# Altium schematic sheet SCH_Project_Final.SchDoc
size A3; SheetNumber: 1; SheetTotal: 1
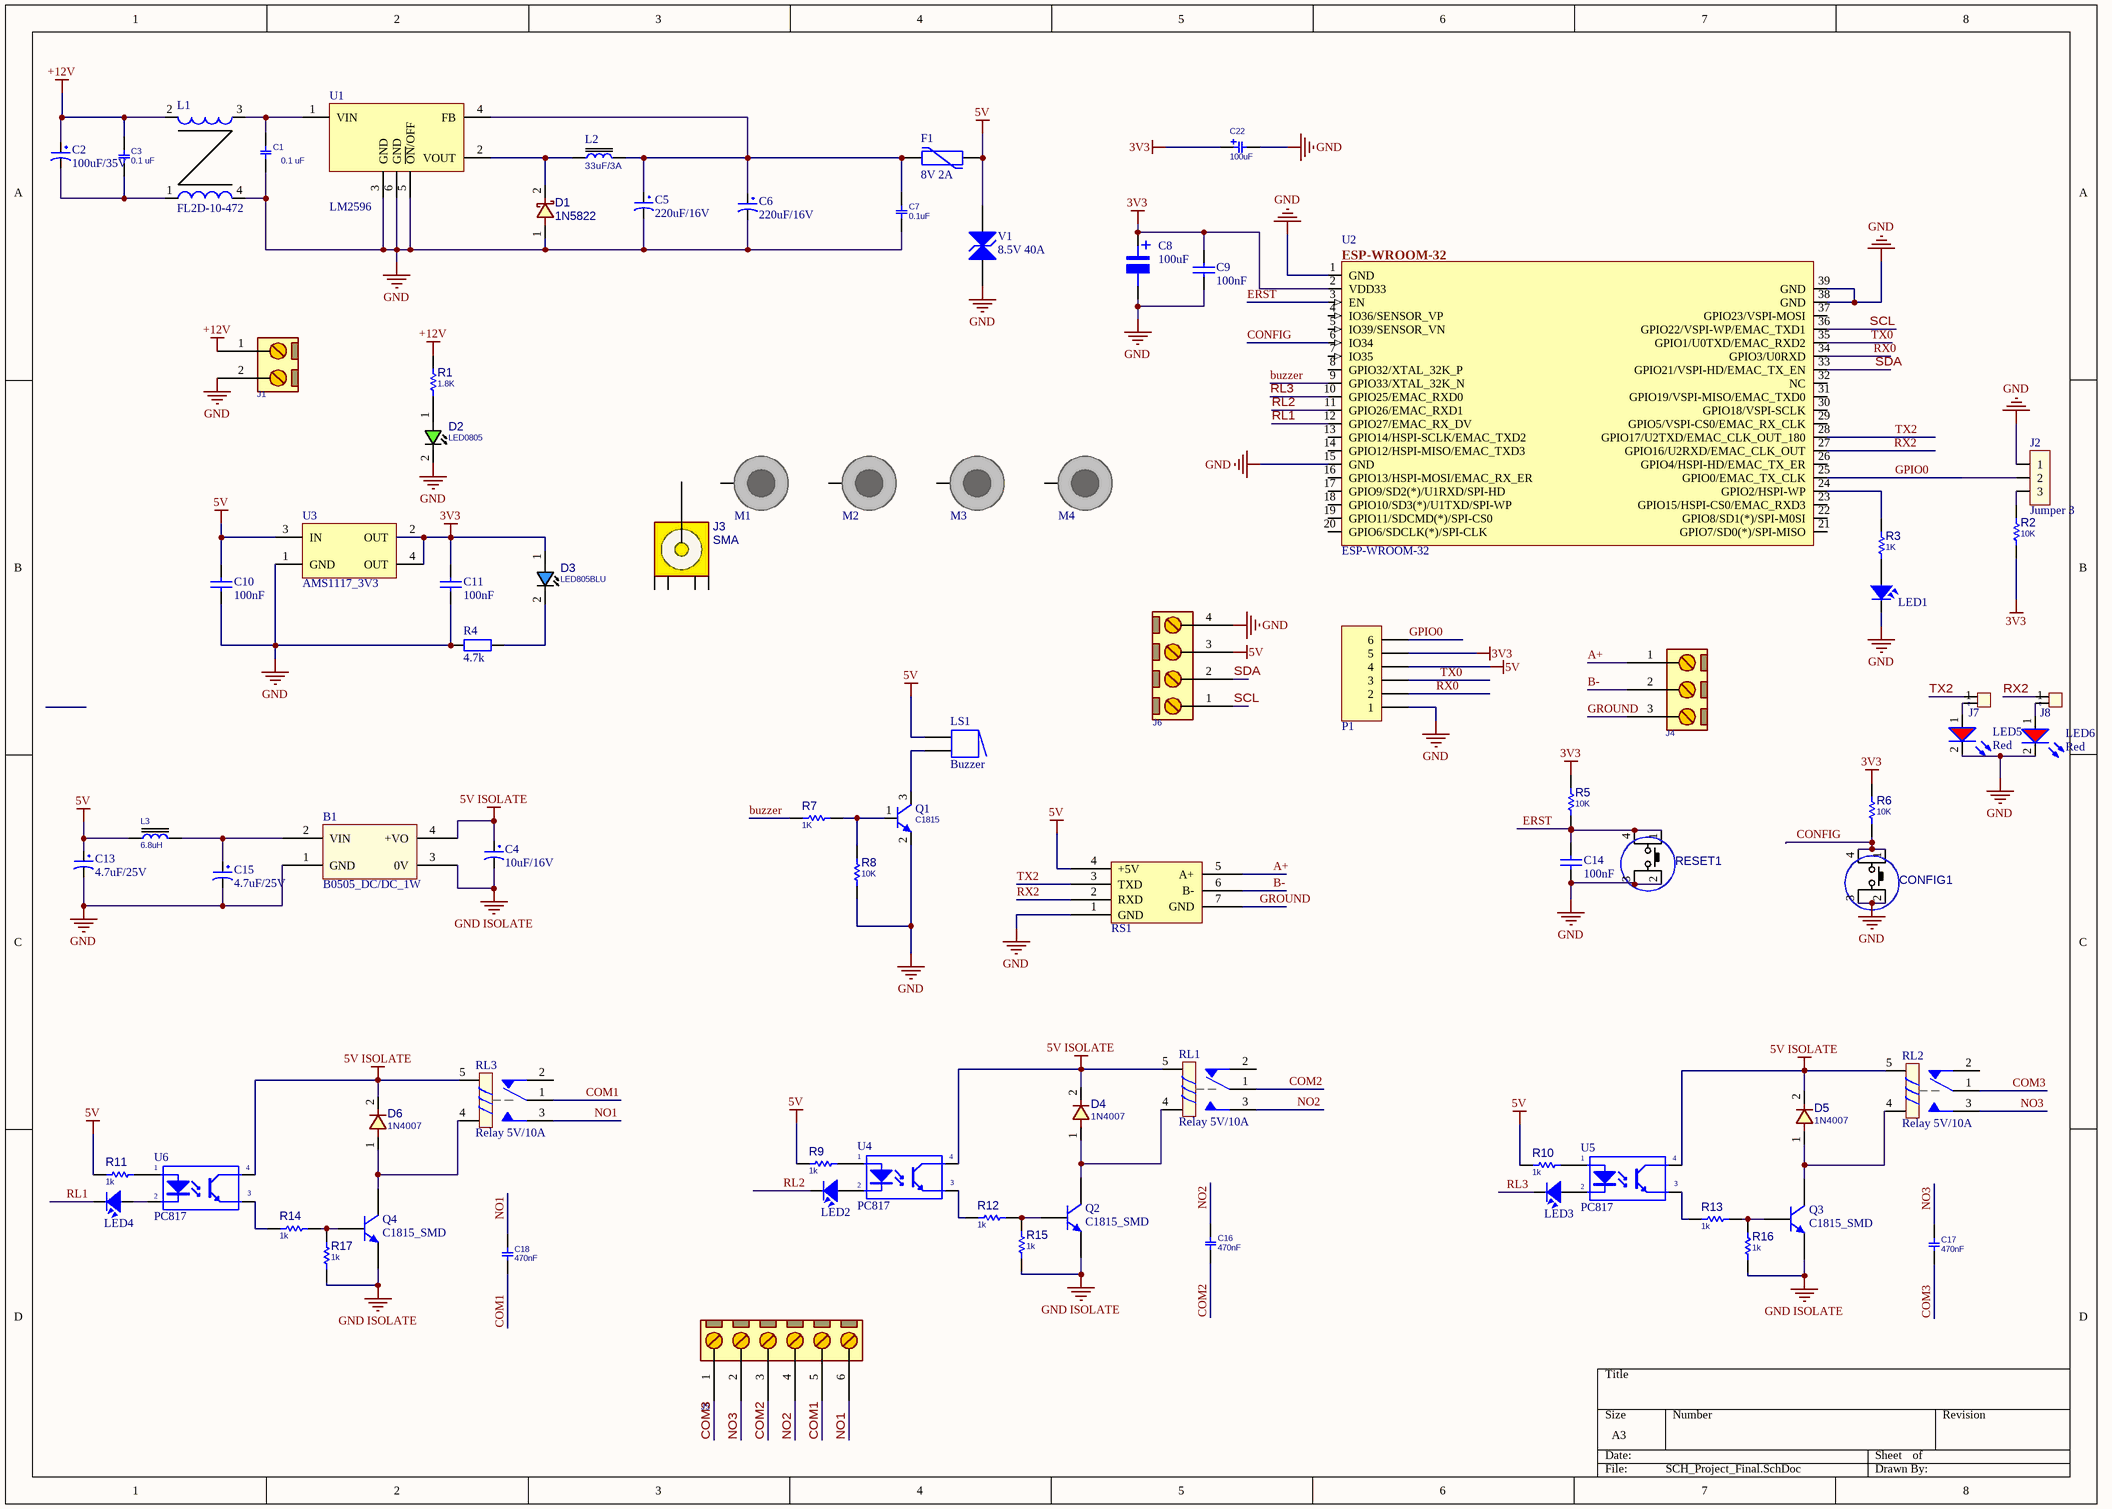
[diagram p0: SCH_Project_Final.SchDoc]

## Parts
B1  B0505_DC/DC_1W  [B0505S_DC/DC_1W]
C1  0.1 uF  [cap_0805]
C2  100uF/35V  [tu hoa 6.5mm]
C3  0.1 uF  [cap_0805]
C4  10uF/16V  [tu hoa 5mm]
C5  220uF/16V  [tu hoa 6.5mm]
C6  220uF/16V  [tu hoa 6.5mm]
C7  0.1uF  [cap_0805]
C8  100uF  [tu nhom 6.3 (d)]
C9  100nF  [cap_0805]
C10  100nF  [cap_0805]
C11  100nF  [cap_0805]
C13  4.7uF/25V  [tu hoa 5mm]
C14  100nF  [cap_0805]
C15  4.7uF/25V  [tu hoa 5mm]
C16  470nF  [C_PLY_19X8]
C17  470nF  [C_PLY_19X8]
C18  470nF  [C_PLY_19X8]
C22  100uF  [C_TN_7343]
CONFIG1  PUSHBUTTON  [SWPBS_SPDT_6X6X5]  (value not drawn)
D1  1N5822  [DIODE_SMD]
D2  LED0805  [LED0805]
D3  LED805BLU  [LED0805RED]
D4  1N4007  [D_SMA]
D5  1N4007  [D_SMA]
D6  1N4007  [D_SMA]
F1  8V 2A  [FUSE_RESETTABLE_SMD_1812]
J1  CONN_TB2  [MSTB_2]  (value not drawn)
J2  Jumper 3  [JP3]
J3  SMA  [SMA_RA]
J4  CONN_TB3  [MSTB_3]  (value not drawn)
J5  CONN_TB6  [MSTB_6]  (value not drawn)
J6  CONN_TB4  [MSTB_4]  (value not drawn)
J7  Jumper 2  [JP2]  (value not drawn)
J8  Jumper 2  [JP2]  (value not drawn)
L1  FL2D-10-472  [INDC_FL2D-10-472]
L2  33uF/3A  [L_BODY 12X12]
L3  6.8uH  [L1008]
LED1  LED  [LED0805GRN]  (value not drawn)
LED2  LED  [LED0805BLU]  (value not drawn)
LED3  LED  [LED0805BLU]  (value not drawn)
LED4  LED  [LED0805BLU]  (value not drawn)
LED5  value Red  [LED5R]  (hidden comment: LED_R_3)
LED6  value Red  [LED5R]  (hidden comment: LED_R_3)
LS1  Buzzer  [Buzzer]
M1  DNP/MH  [SCMH_M4]  (value not drawn)  (no BOM)
M2  DNP/MH  [SCMH_M4]  (value not drawn)  (no BOM)
M3  DNP/MH  [SCMH_M4]  (value not drawn)  (no BOM)
M4  DNP/MH  [SCMH_M4]  (value not drawn)  (no BOM)
P1  Header 6  [JP6]  (value not drawn)
Q1  C1815  [SOT23_3]
Q2  C1815_SMD  [trans_smd]
Q3  C1815_SMD  [trans_smd]
Q4  C1815_SMD  [trans_smd]
R1  1.8K  [R0805]
R2  10K  [R0805]
R3  1K  [R0805]
R4  4.7k  [RES-SMD-0805]
R5  10K  [R0805]
R6  10K  [R0805]
R7  1K  [R0805]
R8  10K  [R0805]
R9  1k  [R0805]
R10  1k  [R0805]
R11  1k  [R0805]
R12  1k  [R0805]
R13  1k  [R0805]
R14  1k  [R0805]
R15  1k  [R0805]
R16  1k  [R0805]
R17  1k  [R0805]
RESET1  PUSHBUTTON  [SWPBS_SPDT_6X6X5]  (value not drawn)
RL1  Relay 5V/10A  [RL_10A_5V]
RL2  Relay 5V/10A  [RL_10A_5V]
RL3  Relay 5V/10A  [RL_10A_5V]
RS1  RS485_VISION2  [RS485 - Version2]  (value not drawn)
U1  LM2596  [TO263-5]
U2  ESP-WROOM-32  [ESP32 WROOM]
U3  AMS1117_3V3  [SOT223-4M]
U4  PC817  [PhotoCoupler_SMD]
U5  PC817  [PhotoCoupler_SMD]
U6  PC817  [PhotoCoupler_SMD]
V1  8.5V 40A  [INDC0805]

## Nets
3V3: C8.1 C9.1 C11.1 C22.1 D3.1(ANODE) P1.5 R2.2 R5.1 R6.1 U2.2(VDD33) U3.2(OUT) U3.4(OUT)
5V: C10.1 C13.1 F1.2 J6.3 L3.1 LS1.1 P1.4 R9.2 R10.2 R11.2 RS1.4(+5V) U3.3(IN) V1.1
5V ISOLATE: B1.4(+VO) C4.1 D4.2 D5.2 D6.2 RL1.5 RL2.5 RL3.5 U4.4(C) U5.4(C) U6.4(C)
+12V: C2.1 C3.2 J1.1 L1.2 R1.2
GND: B1.1(GND) C1.1 C5.2 C6.2 C7.1 C8.2 C9.2 C10.2 C11.2 C13.2 C14.2 C15.2 C22.2 CONFIG1.2(P3) CONFIG1.3(P4) D1.1 D2.2(CATHODE) J1.2 J2.1 J6.4 L1.4 LED1.2 LED5.2(K) LED6.2(K) P1.1 Q1.2(E) R4.2 R8.2 RESET1.2(P3) RESET1.3(P4) RS1.1(GND) U1.3(GND) U1.5(~{ON}/OFF) U1.6(GND) U2.1(GND) U2.15(GND) U2.38(GND) U2.39(GND) U3.1(GND) V1.2
GND ISOLATE: B1.3(0V) C4.2 Q2.2(E) Q3.2(E) Q4.2(E) R15.1 R16.1 R17.1
A+: J4.1 RS1.5(A+)
B-: J4.2 RS1.6(B-)
buzzer: R7.2 U2.9(GPIO33/XTAL_32K_N)
COM1: C18.1 J5.5 RL3.1
COM2: C16.1 J5.3 RL1.1
COM3: C17.1 J5.1 RL2.1
CONFIG: CONFIG1.1(P1) CONFIG1.4(P2) R6.2 U2.6(IO34)
ERST: C14.1 R5.2 RESET1.1(P1) RESET1.4(P2) U2.3(EN)
GPIO0: J2.2 P1.6 U2.25(GPIO0/EMAC_TX_CLK)
GROUND: J4.3 RS1.7(GND)
NO1: C18.2 J5.6 RL3.3
NO2: C16.2 J5.4 RL1.3
NO3: C17.2 J5.2 RL2.3
RL1: LED4.2 U2.12(GPIO27/EMAC_RX_DV)
RL2: LED2.2 U2.11(GPIO26/EMAC_RXD1)
RL3: LED3.2 U2.10(GPIO25/EMAC_RXD0)
RX0: P1.2 U2.34(GPIO3/U0RXD)
RX2: J8.2 RS1.2(RXD) U2.27(GPIO16/U2RXD/EMAC_CLK_OUT)
SCL: J6.1 U2.36(GPIO22/VSPI-WP/EMAC_TXD1)
SDA: J6.2 U2.33(GPIO21/VSPI-HD/EMAC_TX_EN)
TX0: P1.3 U2.35(GPIO1/U0TXD/EMAC_RXD2)
TX2: J7.2 RS1.3(TXD) U2.28(GPIO17/U2TXD/EMAC_CLK_OUT_180)
NetB1_2: B1.2(VIN) C15.1 L3.2
NetC1_2: C1.2 L1.3 U1.1(VIN)
NetC2_2: C2.2 C3.1 L1.1
NetC5_1: C5.1 C6.1 C7.2 F1.1 L2.2 U1.4(FB)
NetD1_2: D1.2 L2.1 U1.2(VOUT)
NetD2_1: D2.1(ANODE) R1.1
NetD3_2: D3.2(CATHODE) R4.1
NetD4_1: D4.1 Q2.3(C) RL1.4
NetD5_1: D5.1 Q3.3(C) RL2.4
NetD6_1: D6.1 Q4.3(C) RL3.4
NetJ2_3: J2.3 R2.1
NetJ7_1: J7.1 LED5.1(A)
NetJ8_1: J8.1 LED6.1(A)
NetLED1_1: LED1.1 R3.1
NetLED2_1: LED2.1 U4.2(K)
NetLED3_1: LED3.1 U5.2(K)
NetLED4_1: LED4.1 U6.2(K)
NetLS1_2: LS1.2 Q1.3(C)
NetQ1_1: Q1.1(B) R7.1 R8.1
NetQ2_1: Q2.1(B) R12.1 R15.2
NetQ3_1: Q3.1(B) R13.1 R16.2
NetQ4_1: Q4.1(B) R14.1 R17.2
NetR3_2: R3.2 U2.24(GPIO2/HSPI-WP)
NetR9_1: R9.1 U4.1(A)
NetR10_1: R10.1 U5.1(A)
NetR11_1: R11.1 U6.1(A)
NetR12_2: R12.2 U4.3(E)
NetR13_2: R13.2 U5.3(E)
NetR14_2: R14.2 U6.3(E)

Not connected (* = marked no-connect by the designer): J3 1(SIG) 2(G1) 3(G2) 4(G3) 5(G4); M1 1; M2 1; M3 1; M4 1; RL1 2; RL2 2; RL3 2; U2 4(IO36/SENSOR_VP) 5(IO39/SENSOR_VN) 7(IO35) 8(GPIO32/XTAL_32K_P) 13(GPIO14/HSPI-SCLK/EMAC_TXD2) 14(GPIO12/HSPI-MISO/EMAC_TXD3) 16(GPIO13/HSPI-MOSI/EMAC_RX_ER) 17(GPIO9/SD2(*)/U1RXD/SPI-HD) 18(GPIO10/SD3(*)/U1TXD/SPI-WP) 19(GPIO11/SDCMD(*)/SPI-CS0) 20(GPIO6/SDCLK(*)/SPI-CLK) 21(GPIO7/SD0(*)/SPI-MISO) 22(GPIO8/SD1(*)/SPI-M0SI) 23(GPIO15/HSPI-CS0/EMAC_RXD3) 26(GPIO4/HSPI-HD/EMAC_TX_ER) 29(GPIO5/VSPI-CS0/EMAC_RX_CLK) 30(GPIO18/VSPI-SCLK) 31(GPIO19/VSPI-MISO/EMAC_TXD0) 32(NC) 37(GPIO23/VSPI-MOSI)

## Notes on the sheet
- (in symbol Tu Nhom 100uF 16V) +

## Library data of the parts
C1 C3 C7 = CAP_SMD_0805: CAP, MLCC, -F, -V, MATERIAL, -%, 0201; PARAM: -, -%; MANF_P#: MANF_PART#; PRICE: 100= 1$; MANF: -; PARAM2: -V; ASSEMBLY: ASSEMBLY
  C1 C3: VALUE: 0.1 uF
  C7: VALUE: 0.1uF
C2 = Tu Hoa 47uF 50V 6x11: Cắm; Don_Vi: Con; So_Chan: 2; Ten_Linh_Kien: Tụ Hóa 47uF 50V; Ma_Hang: MH001360; Chung_Loai: Cắm; Kieu_Chan: *
C4 = Tu Hoa 100uF 16V 5x7: Cắm; Don_Vi: Con; So_Chan: 2; Ten_Linh_Kien: Tụ Hóa 100uF 16V 5x7MM; Ma_Hang: MH001347; Chung_Loai: Cắm; Kieu_Chan: *
C5 C6 = Tu Hoa 100uF 35V 6x8: Cắm; Don_Vi: Con; So_Chan: 2; Ten_Linh_Kien: Tụ Hóa 100uF 35V; Ma_Hang: MH006862; Chung_Loai: Cắm; Kieu_Chan: *
C8 = Tu Nhom 100uF 16V: Dán; Don_Vi: Con; So_Chan: 2; Ten_Linh_Kien: Tụ Nhôm 100uF 16V 6.3x5.4MM; Ma_Hang: MH002219; Chung_Loai: Dán; Kieu_Chan: *
C9-C11 C14 = Tu 0805 106 16V 10%: Dán; Ten_Linh_Kien: Tụ 0805 106-10uF 10% 16V; So_Chan: 2; Don_Vi: Con; Ma_Hang: MH004553; Chung_Loai: Dán; Kieu_Chan: *
C13 C15 = Tu Hoa 47uF 35V 5x11: Cắm; So_Chan: 2; Don_Vi: Con; Ten_Linh_Kien: Tụ Hóa 47uF 35V 5x11MM; Ma_Hang: MH001354; Chung_Loai: Cắm; Kieu_Chan: *
C16-C18 = CAP_THD_FILM_POLYESTER: CAP, FILM,; MANF_P#: MANF_PART#; PARAM2: 400V; PRICE: 100= 1$; DESC: CAP, FILM,; MANF: MANF; ASSEMBLY: ASSEMBLY; VALUE: 470nF
C22 = CAP_SMD_TAN_7343: CAP, SMD, TAN,; PARAM2: -V; VALUE: 100uF
CONFIG1 RESET1 = SWPBS_SPDT_6X6X5: SWITCH, PUSH BUTTON, TACTILE, SMD, SPDT, 6X6X5mm; DESC: DESCRIPTION; MANF: -; VALUE: PUSHBUTTON; ASSEMBLY: ASSEMBLY; PARAM: PARAM; PRICE: PRICE; MANF_P#: -
D1 = DIODE_SMD_SCHOTTKY_1N5822: DIODE, SCHOTTKY, 40V, 3A; MANF: DIODES; DESC: DESCRIPTION; MANF_P#: 1N5822; ASSEMBLY: ASSEMBLY; PRICE: PRICE; PARAM2: 3A; PARAM: 40V; VALUE: 1N5822
D2 = LED_SMD_0805: LED, SMD, 0805; DESC: DESCRIPTION; MANF_P#: MANF_PART#; PARAM2: 2.2V; MANF: MANF; ASSEMBLY: ASSEMBLY; PRICE: PRICE; VALUE: LED0805
D3 = LED_SMD_0805_BLU: LED, SMD, 0805, BLUE; DESC: DESCRIPTION; MANF_P#: MANF_PART#; PARAM2: 2.2V; MANF: MANF; ASSEMBLY: ASSEMBLY; PRICE: 36t@Javan; VALUE: LED805BLU
D4-D6 = DIODE_SMD_1N4007: DIODE, GENERAL PURPOSE, 1000V/1A; MANF: Kingtronics; DESC: DESCRIPTION; PARAM: 1000V VRRM; PARAM2: 1A; MANF_P#: M7; ASSEMBLY: ASSEMBLY; PRICE: PRICE; VALUE: 1N4007
F1 = FUSE_MF-MSMF200-2: PTC RESET FUSE 8V 2A 1812; Manufacturer: Bourns; Number of Terminals/Pins: 2; Max Current Rating: 40A; Power Dissipation: 800mW; Trip Current: 4A; Resistance: 80mR; Time to Trip: 3s; Aging: 1000 hr @ +85 °C (Passive); Approvals: UL,CSA,TUV; Supplier 1: Digi-Key; Supplier Part Number 1: MF-MSMF200-2CT-ND; Manufacturer Part Number: MF-MSMF200-2; RoHS: Yes; Category: Fuses; Stock 1: 15085; Pricing 1: 1=0.67000, 5=0.65000, 10=0.63000, 50=0.53000, 100=0.44000, 250=0.40000, 500=0.33998, 1000=0.29998 (USD); Mount: PCB,Surface Mount; Case/Package: 1812; Number of Pins: 2; Case Code (Metric): 4532; Case Code (Imperial): 1812; Terminal Material: Gold; Min Operating Temperature: -40°C; Max Operating Temperature: 85°C; Hold Current: 2A; Current Rating: 40A; Package Quantity: 2000; Packaging: Tape and Reel; Operating Supply Voltage: 8V; Voltage Rating: 8V; Termination: SMD/SMT; Max Power Dissipation: 800mW; Voltage Rating (DC): 8V; Series: MF-MSMF; Length: 4.73mm; Width: 3.41mm; Height: 0.85mm; Radiation Hardening: No; REACH SVHC: No SVHC; Lead Free: Lead Free; RoHS Compliant: Yes; ComponentLink1URL: https://datasheet.ciiva.com/326/mfmsmf-326966.pdf?src-supplier=Digi-Key; ComponentLink1Description: https://datasheet.ciiva.com/326/mfmsmf-326966.pdf?src-supplier=Digi-Key; ComponentLink2URL: https://datasheet.ciiva.com/326/mfmsmf-326967.pdf?src-supplier=Digi-Key; ComponentLink2Description: https://datasheet.ciiva.com/326/mfmsmf-326967.pdf?src-supplier=Digi-Key; ComponentLink3URL: https://datasheet.ciiva.com/1274/1786007-1274556.pdf?src-supplier=Element14; ComponentLink3Description: https://datasheet.ciiva.com/1274/1786007-1274556.pdf?src-supplier=Element14; ComponentLink4URL: https://datasheet.ciiva.com/1228/1786007-1228163.pdf?src-supplier=Newark; ComponentLink4Description: https://datasheet.ciiva.com/1228/1786007-1228163.pdf?src-supplier=Newark; ComponentLink5URL: https://datasheet.ciiva.com/3020/mfmsmf-3020419.pdf?src-supplier=Avnet; ComponentLink5Description: https://datasheet.ciiva.com/3020/mfmsmf-3020419.pdf?src-supplier=Avnet; ComponentLink6URL: https://datasheet.ciiva.com/326/mfmsmf-326968.pdf?src-supplier=Digi-Key; ComponentLink6Description: https://datasheet.ciiva.com/326/mfmsmf-326968.pdf?src-supplier=Digi-Key; ComponentLink7URL: https://datasheet.ciiva.com/16692/mfmsmf-16692201.pdf?src-supplier=Avnet+Europe; ComponentLink7Description: https://datasheet.ciiva.com/16692/mfmsmf-16692201.pdf?src-supplier=Avnet+Europe; ComponentLink8URL: https://datasheet.ciiva.com/3019/mfmsmf-3019786.pdf?src-supplier=Avnet; ComponentLink8Description: https://datasheet.ciiva.com/3019/mfmsmf-3019786.pdf?src-supplier=Avnet; ComponentLink9URL: https://datasheet.ciiva.com/28411/1786007-28411578.pdf?src-supplier=Element14; ComponentLink9Description: https://datasheet.ciiva.com/28411/1786007-28411578.pdf?src-supplier=Element14; ComponentLink10URL: https://datasheet.ciiva.com/15187/getdatasheetpartid-117210-15187148.pdf?src-supplier=Verical; ComponentLink10Description: https://datasheet.ciiva.com/15187/getdatasheetpartid-117210-15187148.pdf?src-supplier=Verical; ComponentLink11URL: https://datasheet.ciiva.com/1274/1786007-1274557.pdf?src-supplier=Element14; ComponentLink11Description: https://datasheet.ciiva.com/1274/1786007-1274557.pdf?src-supplier=Element14; ComponentLink12URL: https://datasheet.ciiva.com/30196/575mfmsmf-30196429.pdf?src-supplier=Onlinecomponents.com; ComponentLink12Description: https://datasheet.ciiva.com/30196/575mfmsmf-30196429.pdf?src-supplier=Onlinecomponents.com
J1 = CONN_MSTB_2: CONN, PHOENIX MSTB, 5-G, 5.08mm pitch; VALUE: CONN_TB2
J2 = JP3: Value: J3
J3 = CONN_RF_SMA_RA: CONN, RF, SMA, Right Angle; MANF_P#: SMA-J-P-H-RA-TH1; MANF: Samtec; PARAM: 50Ohm, 20GHz; DESC: DESCRIPTION; DIST#: DIGIKEY; PARAM2: GOLD; ASSEMBLY: ASSEMBLY; PRICE: 6.3$; VALUE: SMA
J4 = CONN_MSTB_3: CONN, PHOENIX MSTB, 5-G, 5.08mm pitch; VALUE: CONN_TB3
J5 = CONN_MSTB_6: CONN, PHOENIX MSTB, 5-G, 5.08mm pitch; VALUE: CONN_TB6
J6 = CONN_MSTB_4: CONN, PHOENIX MSTB, 5-G, 5.08mm pitch; VALUE: CONN_TB4
J7 J8 = JP 2: Value: JP 2
L1 = IND_FL2D-10-472: 4.7uH, 1A
L2 = L_BODY_13.5X12.5: VALUE: 33uF/3A
L3 = IND_SMD_6.8uH_1.6A_1008: INDUCTOR, 6.8uH, 1.6A, 440mOhm, 1008; PARAM: 1.6A (Isat); MANF_P#: VLS252012HBU-6R8M; MANF: TDK; PARAM2: 440mOhm, -40~105oC; PRICE: 0.6$; ASSEMBLY: ASSEMBLY; VALUE: 6.8uH
LED1-LED4 = LED SMD: Value: LED 3 - 5 ly 2 Colour
LED5 LED6 = LED_RED_3MM: LED Red 3mm/5MM; ComponentLink1Description: Datasheet; ComponentLink1URL: D:\Dropbox\Datasheets\Opto and Illumination\LEDs\SMD LED.pdf; Unit Price: 0.0476
LS1 = Buzzer: Magnetic Transducer Buzzer; Published: 24-Mar-1999; LatestRevisionDate: 17-Dec-2003; LatestRevisionNote: Schematic revised, PCB Footprint replaced.; DatasheetDocument: 17-Dec-2003; PackageReference: ABSM-1574; Publisher: Altium Limited; ComponentLink1Description: Manufacturer Link; ComponentLink1URL: http://www.megastar.com/linecard/buzzmode/index.php
M1-M4 = SCMH_M4: SCREW mouting, M4, 4mm diameter and 8.0mm PanHead; ASSEMBLY: DNP; VALUE: DNP/MH
P1 = Header 6: Header, 6-Pin; LatestRevisionDate: 17-Jul-2002; LatestRevisionNote: Re-released for DXP Platform.; Publisher: Altium Limited
Q1 = NPN_C1815_SOT23: BJT, NPN, 50v, 0.15A, SMD, SOT23; PARAM2: 250mW; PARAM: 50v, 0.15A; MANF_P#: C1815; MANF: -; VALUE: C1815
Q2-Q4 = C1815_SMD: NPN General Purpose Amplifier; Published: 8-Jun-2000; LatestRevisionDate: 15-Jan-2003; LatestRevisionNote: PCB Footprint 'BCY-W3/D4.7' replaced; DatasheetVersion: 1997; PackageVersion: Sep-1998; PackageReference: TO-92A; Publisher: Altium Limited; Code_JEDEC: TO-92A; ComponentLink1Description: Manufacturer Link; ComponentLink1URL: http://www.fairchildsemi.com/; ComponentLink2Description: Datasheet; ComponentLink2URL: http://www.fairchildsemi.com/ds/2N%2F2N3904.pdf
R1 = RES_SMD_0805: RESISTOR, SMD, SENS, 0.01Ohm, 0.5W; MANF_P#: WSLP0805R0100FEA; MANF: VISHAY; PARAM: 0.5W, -55~155oC; DESC: DESCRIPTION; DIST#: MOUSER; PARAM2: 1%; ASSEMBLY: ASSEMBLY; PRICE: 0.5$; VALUE: 1.8K
R2 R3 R5-R17 = RES_SMD_0805: RESISTOR, SMD; PARAM: -W; DESC: DESCRIPTION; DIST#: MOUSER; PARAM2: 1%; MANF_P#: -; MANF: -; ASSEMBLY: ASSEMBLY; PRICE: 100= 0.5$
  R2 R5 R6 R8: VALUE: 10K
  R3 R7: VALUE: 1K
  R9-R17: VALUE: 1k
R4 = Tro 0805 5% 1.8k: Dán; Don_Vi: Con; So_Chan: 2; Ten_Linh_Kien: Trở 0805 5% 1.8k; Ma_Hang: MH005233; Chung_Loai: Dán; Kieu_Chan: *
RL1-RL3 = Relay 5V10A: Relay SPDT,10A - 12VDC 5 Pin; Value: Relay SPDT, 10A, 12V
U1 = LM2596: 1A Regulator
U3 = AMS1117_3V3: 1A Regulator
U4-U6 = PC817_1: Single Opto; Value: PC817
V1 = VARISTOR_VC080505A150RP: VARISTOR 8.5V 40A 0805; Manufacturer: Kyocera AVX; Number of Terminals/Pins: 2; Capacitance: 1.1nF; Max Voltage Rating (AC): 4V; Max Voltage Rating (DC): 5.6V; Clamping Current: 1A; Clamping Voltage: 18V; Number of Circuits: 1; Energy: 0.1J; ESD Protection: Yes; Voltage Tolerance: 20%; Min Varistor Voltage: 6.8V; Max Varistor Voltage: 10.2V; Current Rating: 1mA; Supplier 1: Digi-Key; Supplier Part Number 1: 478-11137-2-ND; Manufacturer Part Number: VC080505A150RP; RoHS: Yes; Category: Varistors; Pricing 1: 4000=0.11550, 8000=0.10850, 12000=0.10150, 28000=0.09310 (USD); Mount: Surface Mount; Case/Package: 0805; Case Code (Imperial): 0805; Case Code (Metric): 2012; Material: Ceramic; Contact Plating: Tin,Matte; Min Operating Temperature: -55°C; Max Operating Temperature: 125°C; Varistor Voltage: 8.5V; Max Surge Current: 40A; Voltage Rating: 5.6V; Voltage Rating (AC): 4V; Voltage Rating (DC): 5.6V; Packaging: Tape and Reel; Max Output Current: 40A; Package Quantity: 4000; Termination: SMD/SMT; Operating Supply Voltage: 5.6V; Length: 2.01mm; Width: 1.25mm; Depth: 1.25mm; REACH SVHC: No SVHC; Lead Free: Lead Free; RoHS Compliant: Yes; ComponentLink1URL: https://datasheet.ciiva.com/34302/1155151-34302026.pdf?src-supplier=Jameco; ComponentLink1Description: https://datasheet.ciiva.com/34302/1155151-34302026.pdf?src-supplier=Jameco; ComponentLink2URL: https://datasheet.ciiva.com/3024/tguard-3024149.pdf?src-supplier=Avnet; ComponentLink2Description: https://datasheet.ciiva.com/3024/tguard-3024149.pdf?src-supplier=Avnet; ComponentLink3URL: https://datasheet.ciiva.com/7971/tguard-7971624.pdf?src-supplier=Element14; ComponentLink3Description: https://datasheet.ciiva.com/7971/tguard-7971624.pdf?src-supplier=Element14; ComponentLink4URL: https://datasheet.ciiva.com/369/tguard-369629.pdf?src-supplier=Digi-Key; ComponentLink4Description: https://datasheet.ciiva.com/369/tguard-369629.pdf?src-supplier=Digi-Key